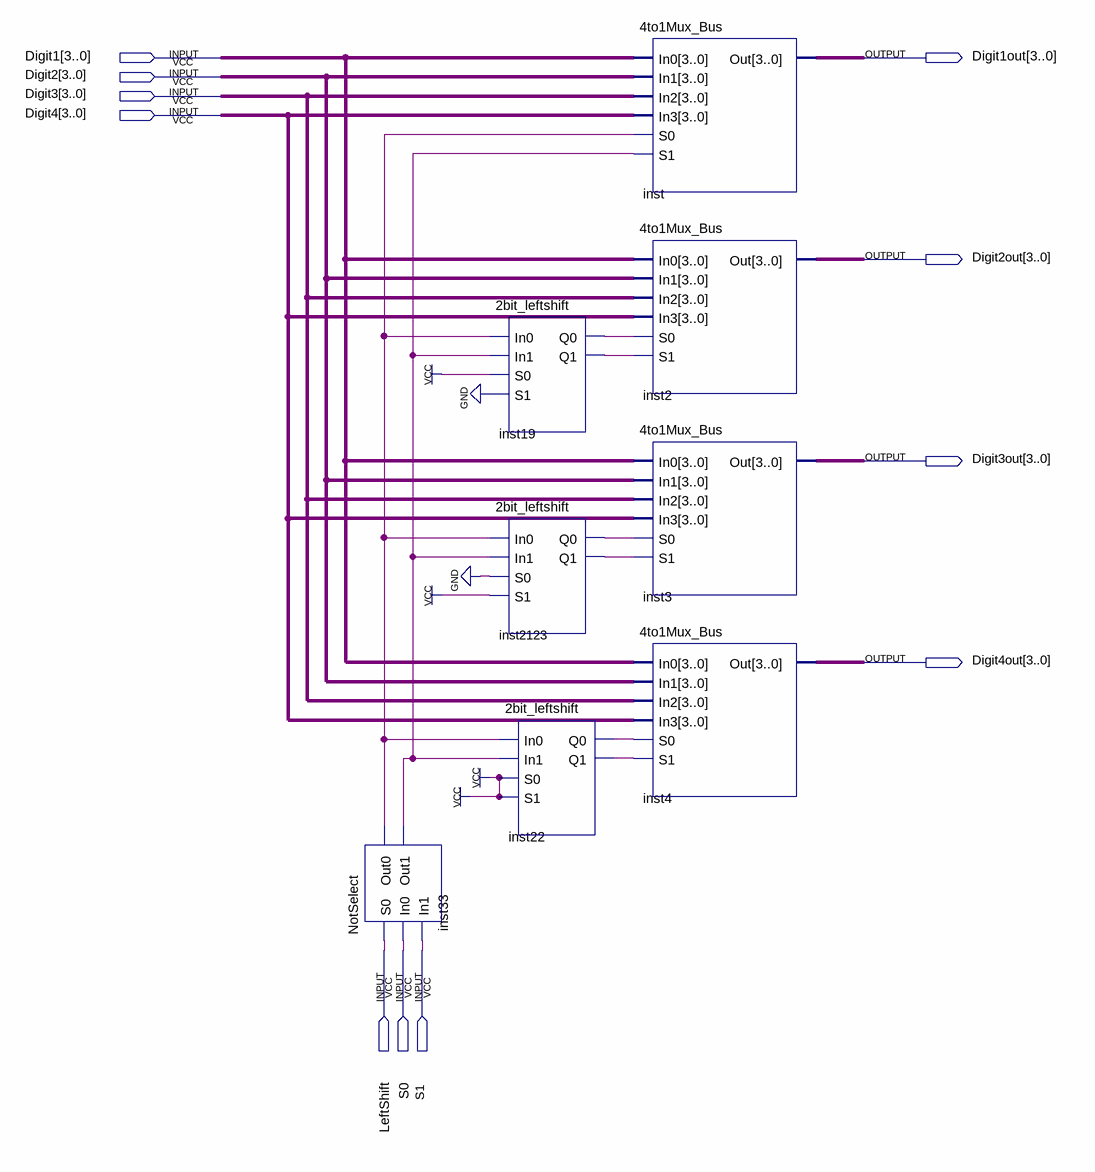
[diagram p0: schematic sheet]
// Quartus schematic Digit_leftshift.bdf as structural Verilog: 8 symbols, 11 pins
module Digit_leftshift (
  input  [3:0] Digit1,
  input  [3:0] Digit2,
  input  [3:0] Digit3,
  input  [3:0] Digit4,
  input  LeftShift,
  input  S0,
  input  S1,
  output [3:0] Digit1out,
  output [3:0] Digit2out,
  output [3:0] Digit3out,
  output [3:0] Digit4out
);

  wire inst19_q0, inst19_q1, inst22_q0, inst22_q1, inst33_out0, inst33_out1, inst2123_q0, inst2123_q1;

  NotSelect inst33 (.S0(LeftShift), .In0(S0), .In1(S1), .Out0(inst33_out0), .Out1(inst33_out1));
  \2bit_leftshift  inst19 (.In0(inst33_out0), .S0(1'b1), .In1(inst33_out1), .S1(1'b0), .Q0(inst19_q0), .Q1(inst19_q1));
  \2bit_leftshift  inst2123 (
    .In0(inst33_out0), .S0(1'b0), .In1(inst33_out1), .S1(1'b1), .Q0(inst2123_q0), .Q1(inst2123_q1));
  \2bit_leftshift  inst22 (.In0(inst33_out0), .S0(1'b1), .In1(inst33_out1), .S1(1'b1), .Q0(inst22_q0), .Q1(inst22_q1));
  \4to1Mux_Bus  inst (
    .In0(Digit1), .In1(Digit2), .In2(Digit3), .In3(Digit4), .S0(inst33_out0), .S1(inst33_out1),
    .Out(Digit1out));
  \4to1Mux_Bus  inst2 (
    .In0(Digit1), .In1(Digit2), .In2(Digit3), .In3(Digit4), .S0(inst19_q0), .S1(inst19_q1), .Out(Digit2out));
  \4to1Mux_Bus  inst3 (
    .In0(Digit1), .In1(Digit2), .In2(Digit3), .In3(Digit4), .S0(inst2123_q0), .S1(inst2123_q1),
    .Out(Digit3out));
  \4to1Mux_Bus  inst4 (
    .In0(Digit1), .In1(Digit2), .In2(Digit3), .In3(Digit4), .S0(inst22_q0), .S1(inst22_q1), .Out(Digit4out));
endmodule
